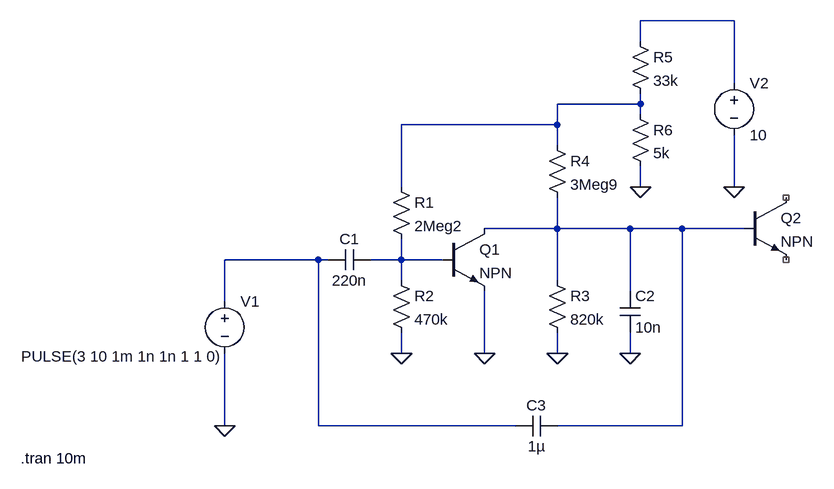
[diagram p0: schematic Auto_return.asc]
Auto_return.asc, the LTspice schematic file:
Version 4
SHEET 1 912 680
WIRE 784 -48 640 -48
WIRE 640 -16 640 -48
WIRE 784 48 784 -48
WIRE 640 80 640 64
WIRE 640 80 512 80
WIRE 640 96 640 80
WIRE 512 112 512 80
WIRE 512 112 272 112
WIRE 512 144 512 112
WIRE 272 208 272 112
WIRE 640 208 640 176
WIRE 784 208 784 128
WIRE 512 272 512 224
WIRE 512 272 400 272
WIRE 624 272 512 272
WIRE 704 272 624 272
WIRE 800 272 704 272
WIRE 144 320 0 320
WIRE 160 320 144 320
WIRE 272 320 272 288
WIRE 272 320 224 320
WIRE 336 320 272 320
WIRE 272 352 272 320
WIRE 512 352 512 272
WIRE 624 368 624 272
WIRE 0 384 0 320
WIRE 272 464 272 432
WIRE 400 464 400 368
WIRE 512 464 512 432
WIRE 624 464 624 432
WIRE 0 576 0 464
WIRE 144 576 144 320
WIRE 448 576 144 576
WIRE 704 576 704 272
WIRE 704 576 512 576
FLAG 272 464 0
FLAG 400 464 0
FLAG 512 464 0
FLAG 624 464 0
FLAG 0 576 0
FLAG 640 208 0
FLAG 784 208 0
SYMBOL npn 336 272 R0
SYMATTR InstName Q1
SYMBOL npn 800 224 R0
SYMATTR InstName Q2
SYMBOL res 256 192 R0
SYMATTR InstName R1
SYMATTR Value 2Meg2
SYMBOL res 256 336 R0
SYMATTR InstName R2
SYMATTR Value 470k
SYMBOL cap 224 304 R90
WINDOW 0 0 32 VBottom 2
WINDOW 3 32 32 VTop 2
SYMATTR InstName C1
SYMATTR Value 220n
SYMBOL res 496 336 R0
SYMATTR InstName R3
SYMATTR Value 820k
SYMBOL res 496 128 R0
SYMATTR InstName R4
SYMATTR Value 3Meg9
SYMBOL cap 608 368 R0
SYMATTR InstName C2
SYMATTR Value 10n
SYMBOL cap 512 560 R90
WINDOW 0 0 32 VBottom 2
WINDOW 3 32 32 VTop 2
SYMATTR InstName C3
SYMATTR Value 1µ
SYMBOL voltage 0 368 R0
WINDOW 3 -313 101 Left 2
WINDOW 123 0 0 Left 0
WINDOW 39 0 0 Left 0
SYMATTR InstName V1
SYMATTR Value PULSE(3 10 1m 1n 1n 1 1 0)
SYMBOL res 624 -32 R0
SYMATTR InstName R5
SYMATTR Value 33k
SYMBOL res 624 80 R0
SYMATTR InstName R6
SYMATTR Value 5k
SYMBOL voltage 784 32 R0
WINDOW 123 0 0 Left 0
WINDOW 39 0 0 Left 0
SYMATTR InstName V2
SYMATTR Value 10
TEXT -314 626 Left 2 !.tran 10m

The netlist it stands for:
* Auto_return.asc
Q1 N003 N005 0 0 NPN
Q2 NC_01 N003 NC_02 0 NPN
R1 N002 N005 2Meg2
R2 N005 0 470k
C1 N005 N004 220n
R3 N003 0 820k
R4 N002 N003 3Meg9
C2 N003 0 10n
C3 N003 N004 1µ
V1 N004 0 PULSE(3 10 1m 1n 1n 1 1 0)
R5 N001 N002 33k
R6 N002 0 5k
V2 N001 0 10
.model NPN NPN
.model PNP PNP
.lib standard.bjt
.tran 10m
.backanno
.end